# Altium project TIDA-00042.PrjPcb
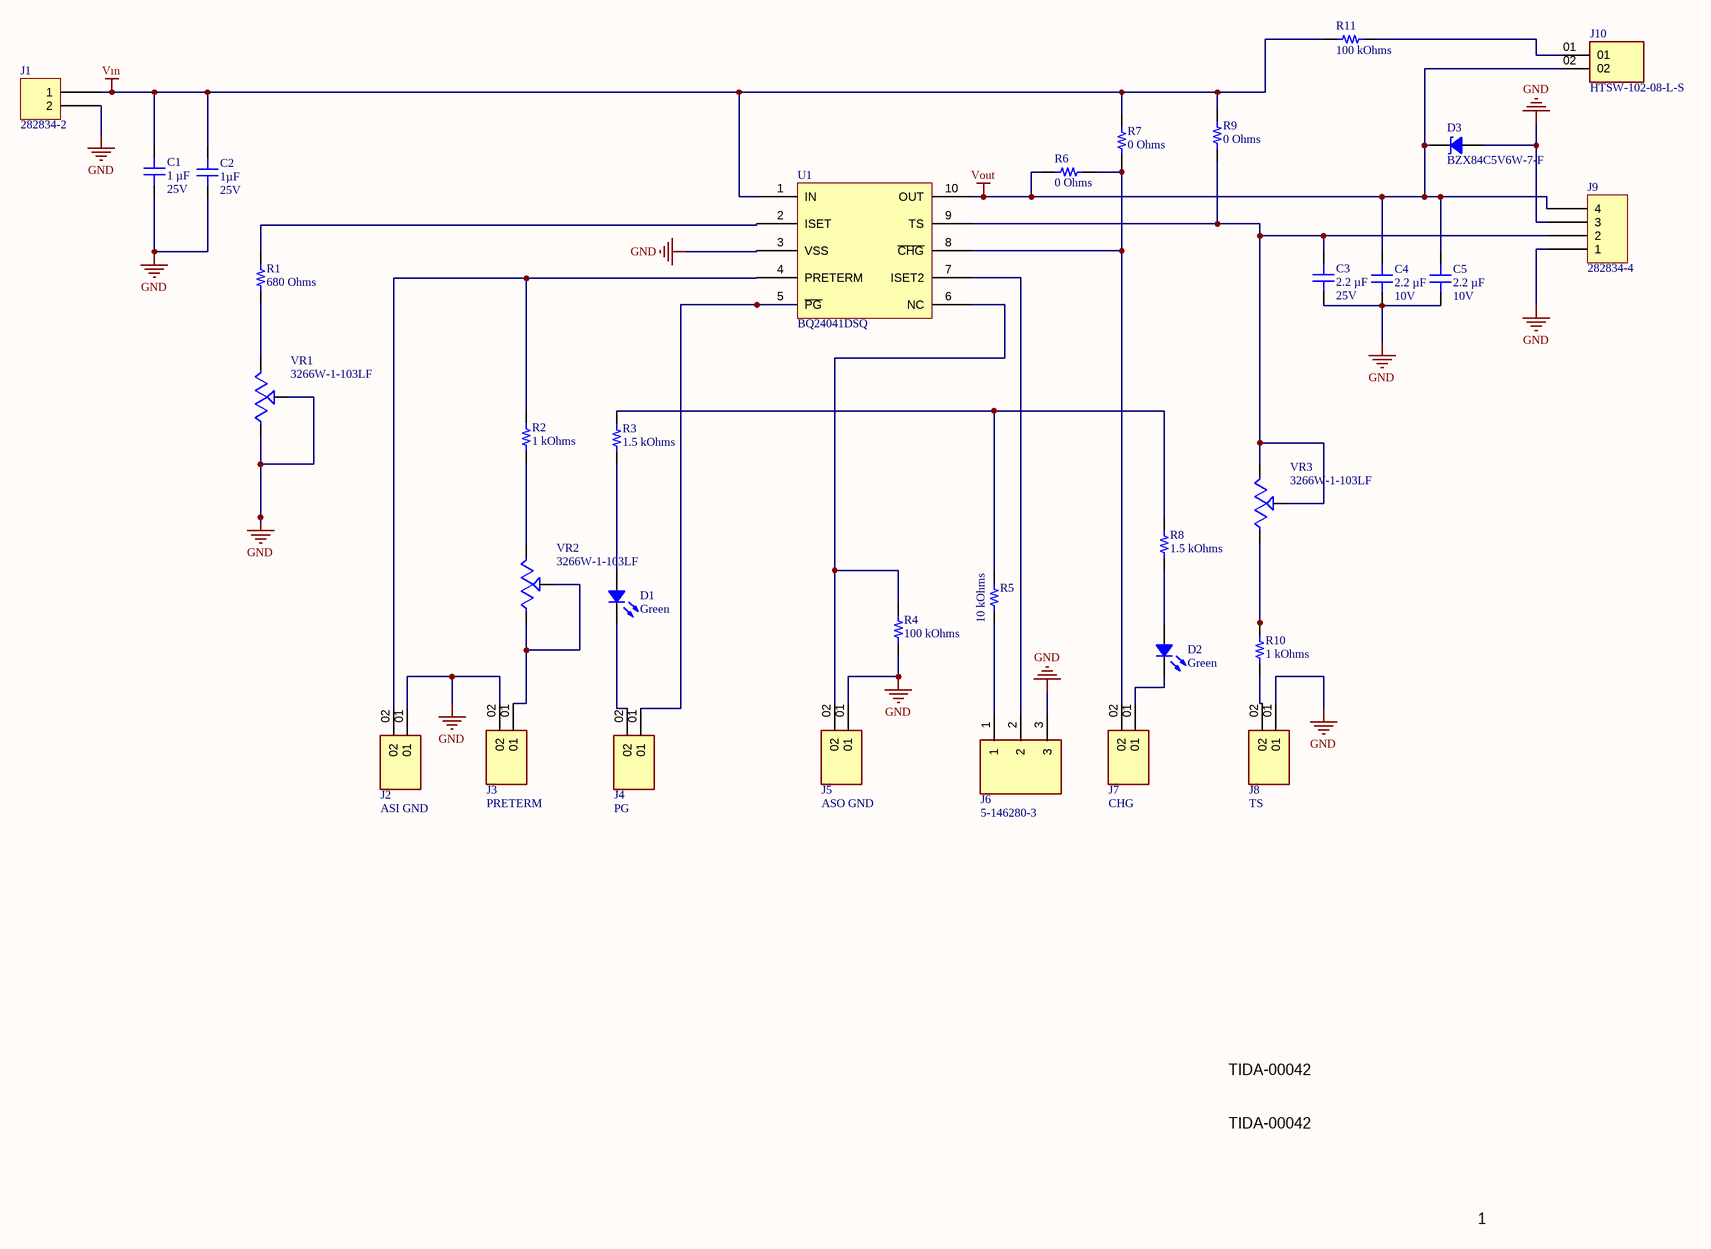
[diagram p0: TIDA-00042 SCHEMATİC.SchDoc]
1 sheet, 33 parts. Net scope: global (net labels, ports and power ports of the same name join across sheets).
Board file: TIDA-00042.PcbDoc

## Sheet TIDA-00042 SCHEMATİC.SchDoc
size 420 x 297 mm; SheetNumber: 1; SheetTotal: 1

### Parts
C1  Voltage - Rated: 25V  [CAP 0603_1608]  (hidden comment: 1 µF)
C2  Voltage - Rated: 25V  [CAP 0805_2012]  (hidden comment: 1µF)
C3  Voltage - Rated: 25V  [CAP 0603_1608]  (hidden comment: 2.2 µF)
C4  Voltage - Rated: 10V  [CAP 0603_1608]  (hidden comment: 2.2 µF)
C5  Voltage - Rated: 10V  [CAP 0805_2012]  (hidden comment: 2.2 µF)
D1  Green  [LED 0603_1608 GREEN]
D2  Green  [LED 0603_1608 GREEN]
D3  BZX84C5V6W-7-F  [DIODES SOT-323-3]
J1  282834-2  [TE 282834-2]
J2  ASI GND  [SAMTEC_HTSW-102-08-L-S]
J3  PRETERM  [SAMTEC_HTSW-102-08-L-S]
J4  PG  [SAMTEC_HTSW-102-08-L-S]
J5  ASO GND  [SAMTEC_HTSW-102-08-L-S]
J6  5-146280-3  [TE_5-146280-3]
J7  CHG  [SAMTEC_HTSW-102-08-L-S]
J8  TS  [SAMTEC_HTSW-102-08-L-S]
J9  282834-4  [TE 282834-4]
J10  HTSW-102-08-L-S  [SAMTEC_HTSW-102-08-L-S]
R1  680 Ohms  [RES 0603_1608]
R2  1 kOhms  [RES 0603_1608]
R3  1.5 kOhms  [RES 0603_1608]
R4  100 kOhms  [RES 0603_1608]
R5  10 kOhms  [RES 0603_1608]
R6  0 Ohms  [RES 0603_1608]
R7  0 Ohms  [RES 0603_1608]
R8  1.5 kOhms  [RES 0603_1608]
R9  0 Ohms  [RES 0603_1608]
R10  1 kOhms  [RES 0603_1608]
R11  100 kOhms  [RES 0603_1608]
U1  BQ24041DSQ  [SON40P200X200X80-11N]
VR1  3266W-1-103LF  [TRIM_3266W-1-103LF]
VR2  3266W-1-103LF  [TRIM_3266W-1-103LF]
VR3  3266W-1-103LF  [TRIM_3266W-1-103LF]

### Nets
GND: C1.1 C2.1 C3.1 C4.1 C5.1 D3.1 J1.2 J2.01 J3.02 J5.01 J6.3 J8.01 J9.1 J9.3 R4.1 U1.3(VSS) VR1.1(CCW) VR1.2(WIPER)
Vout: C4.2 C5.2 D3.2 J9.4 J10.02 R6.2 U1.10(OUT)
Vın: C1.2 C2.2 J1.1 R7.2 R9.2 R11.1 U1.1(IN)
NetC3_2: C3.2 J9.2 R9.1 U1.9(TS) VR3.2(WIPER) VR3.3(CW)
NetD1_1: D1.1 R3.1
NetD1_2: D1.2 J4.02
NetD2_1: D2.1 R8.1
NetD2_2: D2.2 J7.01
NetJ2_02: J2.02 R2.2 U1.4(PRETERM)
NetJ3_01: J3.01 VR2.1(CCW) VR2.2(WIPER)
NetJ4_01: J4.01 U1.5(~{PG})
NetJ5_02: J5.02 R4.2 U1.6(NC)
NetJ6_1: J6.1 R5.1
NetJ6_2: J6.2 U1.7(ISET2)
NetJ7_02: J7.02 R6.1 R7.1 U1.8(~{CHG})
NetJ8_02: J8.02 R10.1
NetJ10_01: J10.01 R11.2
NetR1_1: R1.1 VR1.3(CW)
NetR1_2: R1.2 U1.2(ISET)
NetR2_1: R2.1 VR2.3(CW)
NetR3_2: R3.2 R5.2 R8.2
NetR10_2: R10.2 VR3.1(CCW)

### Notes on the sheet
- TIDA-00042
- 1
- TİTLE:
- PROJECT:
- SİZE:
- A3
- DATE:
- REVİSİON:
- DRAW BY:
- MAHMUT AKÇAKOCA
- SHEET:

### Library data of the parts
C1 = CC0603KRX5R8BB105: CAP CER 1UF 25V X5R 0603; manufacturer: Yageo; Tolerance: ±10%; Part Number: CC0603KRX5R8BB105; Value: 1 µF; Applications: General Purpose; Capacitance: 1 µF; componentlink1description: Datasheet; componentlink1url: https://www.yageo.com/upload/media/product/productsearch/datasheet/mlcc/UPY-GPHC_X5R_4V-to-50V_25.pdf; componentlink2description: DigiKey Link; componentlink2url: https://www.digikey.com/en/products/detail/yageo/CC0603KRX5R8BB105/2833610; Device Package: 0603 (1608 Metric); lastupdated: 25.08.2022 06:49:33; Lifecycle Status: Active; Minimum Order: 1; Mounting Type: Surface Mount, MLCC; Operating Temperature: -55°C ~ 85°C; Package / Case: 0603 (1608 Metric); packaging: TapeAndReel; partid: 5146; Part Status: Active; price: 0.01; series: CC; Size / Dimension: 0.063" L x 0.031" W (1.60mm x 0.80mm); Supplier 1: DigiKey; Supplier Part Number 1: 311-1445-1-ND; Temperature Coefficient: X5R; Thickness (Max): 0.035" (0.90mm)
C2 = 08053D105KAT2A: CAP CER 1UF 25V X5R 0805; manufacturer: AVX Corporation; Tolerance: ±10%; Part Number: 08053D105KAT2A; Value: 1µF; Applications: General Purpose; Capacitance: 1µF; componentlink1description: Datasheet; componentlink1url: http://datasheets.avx.com/cx5r.pdf; componentlink2description: DigiKey Link; componentlink2url: http://digikey.com/product-detail/en/avx-corporation/08053D105KAT2A/478-1409-1-ND/564441; Device Package: 0805 (2012 Metric); lastupdated: 2.09.2020 01:04:40; Lifecycle Status: Active; Minimum Order: 1; Mounting Type: Surface Mount, MLCC; Operating Temperature: -55°C ~ 85°C; Package / Case: 0805 (2012 Metric); packaging: TapeAndReel; partid: 3127; Part Status: Active; price: 0.12; series: -; Size / Dimension: 0.079" L x 0.049" W (2.01mm x 1.25mm); Supplier 1: DigiKey; Supplier Part Number 1: 478-1409-1-ND; Temperature Coefficient: X5R; Thickness (Max): 0.055" (1.40mm)
C3 = CL10A225KA5LNNC: CAP CER 2.2UF 25V X5R 0603; manufacturer: Samsung Electro-Mechanics; Tolerance: ±10%; Part Number: CL10A225KA5LNNC; Value: 2.2 µF; Applications: General Purpose; Capacitance: 2.2 µF; componentlink1description: Datasheet; componentlink1url: http://www.samsungsem.com/kr/support/product-search/mlcc/CL10A225KA5LNNC.jsp; componentlink2description: DigiKey Link; componentlink2url: https://www.digikey.com/en/products/detail/samsung-electro-mechanics/CL10A225KA5LNNC/3887536; Device Package: 0603 (1608 Metric); Features: Low Profile; lastupdated: 25.08.2022 06:49:10; Lifecycle Status: Active; Minimum Order: 1; Mounting Type: Surface Mount, MLCC; Operating Temperature: -55°C ~ 85°C; Package / Case: 0603 (1608 Metric); packaging: TapeAndReel; partid: 12827; Part Status: Active; price: 0.03; series: CL; Size / Dimension: 0.063" L x 0.031" W (1.60mm x 0.80mm); Supplier 1: DigiKey; Supplier Part Number 1: 1276-1878-1-ND; Temperature Coefficient: X5R; Thickness (Max): 0.020" (0.50mm)
C4 = CL10A225KP8NNNC: CAP CER 2.2UF 10V X5R 0603; manufacturer: Samsung Electro-Mechanics; Tolerance: ±10%; Part Number: CL10A225KP8NNNC; Value: 2.2 µF; Applications: General Purpose; Capacitance: 2.2 µF; componentlink1description: Datasheet; componentlink1url: http://www.samsungsem.com/kr/support/product-search/mlcc/CL10A225KP8NNNC.jsp; componentlink2description: DigiKey Link; componentlink2url: https://www.digikey.com/en/products/detail/samsung-electro-mechanics/CL10A225KP8NNNC/3886743; Device Package: 0603 (1608 Metric); lastupdated: 25.08.2022 06:49:32; Lifecycle Status: Active; Minimum Order: 1; Mounting Type: Surface Mount, MLCC; Operating Temperature: -55°C ~ 85°C; Package / Case: 0603 (1608 Metric); packaging: TapeAndReel; partid: 5601; Part Status: Active; price: 0.01; series: CL; Size / Dimension: 0.063" L x 0.031" W (1.60mm x 0.80mm); Supplier 1: DigiKey; Supplier Part Number 1: 1276-1085-1-ND; Temperature Coefficient: X5R; Thickness (Max): 0.035" (0.90mm)
C5 = CC0805KKX5R6BB225: CAP CER 2.2UF 10V X5R 0805; manufacturer: Yageo; Tolerance: ±10%; Part Number: CC0805KKX5R6BB225; Value: 2.2 µF; Applications: General Purpose; Capacitance: 2.2 µF; componentlink1description: Datasheet; componentlink1url: https://www.yageo.com/upload/media/product/productsearch/datasheet/mlcc/UPY-GPHC_X5R_4V-to-50V_25.pdf; componentlink2description: DigiKey Link; componentlink2url: https://www.digikey.com/en/products/detail/yageo/CC0805KKX5R6BB225/5195268; Device Package: 0805 (2012 Metric); lastupdated: 25.08.2022 06:52:53; Lifecycle Status: Active; Minimum Order: 1; Mounting Type: Surface Mount, MLCC; Operating Temperature: -55°C ~ 85°C; Package / Case: 0805 (2012 Metric); packaging: TapeAndReel; partid: 41304; Part Status: Active; price: 0.04; series: CC; Size / Dimension: 0.079" L x 0.049" W (2.00mm x 1.25mm); Supplier 1: DigiKey; Supplier Part Number 1: 311-1862-1-ND; Temperature Coefficient: X5R; Thickness (Max): 0.057" (1.45mm)
D1 D2 = LTST-C190GKT: LED GREEN CLEAR CHIP SMD; Manufacturer: Lite-On Inc.; Configuration: Standard; Current - Test: 10mA; Lens Color: Colorless; Lens Size: 1.10mm x 0.80mm; Lens Style: Rectangle with Flat Top; Millicandela Rating: 6mcd; Viewing Angle: 130°; Voltage - Forward (Vf) (Typ): 2.1V; Wavelength - Dominant: 569nm; Wavelength - Peak: 565nm; Part Number: LTST-C190GKT; Color: Green; ComponentLink1Description: Datasheet; ComponentLink1URL: //media.digikey.com/pdf/Data%20Sheets/Lite-On%20PDFs/LTST-C190GKT.pdf; ComponentLink2Description: DigiKey Link; ComponentLink2URL: http://digikey.com/product-detail/en/lite-on-inc/LTST-C190GKT/160-1183-1-ND/269255; Device Package: 0603 (1608 Metric); Height (Max): 0.90mm; LastUpdated: 25.08.2022 07:37:41; Lens Transparency: Clear; Lifecycle Status: Active; Minimum Order: 1; Mounting Type: Surface Mount; Package / Case: 0603 (1608 Metric); Packaging: TapeAndReel; PartId: 656; Part Status: Active; Price: 0.04; Series: -; Size / Dimension: 1.60mm L x 0.80mm W; Supplier 1: DigiKey; Supplier Part Number 1: 160-1183-1-ND; Supplier Device Package: Chip LED; Value: Green
D3 = BZX84C5V6W-7-F: DIODE ZENER 5.6V 200MW SOT323; Manufacturer: Diodes Incorporated; Current - Reverse Leakage @ Vr: 1 µA @ 2 V; Impedance (Max) (Zzt): 40 Ohms; Tolerance: ±7%; Voltage - Forward (Vf) (Max) @ If: 900 mV @ 10 mA; Part Number: BZX84C5V6W-7-F; ComponentLink1Description: Datasheet; ComponentLink1URL: https://www.diodes.com/assets/Datasheets/ds30066.pdf; ComponentLink2Description: DigiKey Link; ComponentLink2URL: https://www.digikey.com/en/products/detail/diodes-incorporated/BZX84C5V6W-7-F/814913; LastUpdated: 25.08.2022 07:38:41; Lifecycle Status: Active; Minimum Order: 1; Mounting Type: Surface Mount; Operating Temperature: -65°C ~ 125°C; Package / Case: SC-70, SOT-323; Packaging: TapeAndReel; PartId: 879; Part Status: Active; Power - Max: 200 mW; Price: 0.04; Series: -; Supplier 1: DigiKey; Supplier Part Number 1: BZX84C5V6W-FDICT-ND; Supplier Device Package: SOT-323; Voltage - Zener (Nom) (Vz): 5.6 V
J1 = 282834-2: TERM BLK 2P SIDE ENT 2.54MM PCB; Manufacturer: TE Connectivity AMP Connectors; Current: 10A; Mating Orientation: Horizontal with Board; Number of Levels: 1; Pitch: 0.100" (2.54mm); Positions Per Level: 2; Voltage: 150V; Wire Gauge: 16-30 AWG; Wire Termination: Screw - Rising Cage Clamp; Part Number: 282834-2; Color: Green; ComponentLink1Description: Datasheet; ComponentLink1URL: https://www.te.com/commerce/DocumentDelivery/DDEController?Action=srchrtrv&DocNm=282834&DocType=Customer+Drawing&DocLang=English; ComponentLink2Description: DigiKey Link; ComponentLink2URL: http://digikey.com/product-detail/en/te-connectivity-amp-connectors/282834-2/A98333-ND/1150135; LastUpdated: 15.01.2020 04:15:38; Lifecycle Status: Active; Minimum Order: 1; Mounting Type: Through Hole; Packaging: Bulk; Part Status: Active; Price: 0.88; Series: Buchanan; Supplier 1: DigiKey; Supplier Part Number 1: A98333-ND
J2-J5 J7 J8 J10 = HTSW-102-08-L-S: Conn Unshrouded Header HDR 2 POS 2.54mm Solder ST Top Entry Thru-Hole Bag; MF: Samtec Inc.; MP: HTSW-102-08-L-S; Value: *; Availability: In Stock; Package: None; Price: None; SnapEDA_Link: https://www.snapeda.com/parts/HTSW-102-08-L-S/Samtec/view-part/?ref=snap; Purchase-URL: https://pricing.snapeda.com/search/part/HTSW-102-08-L-S/?ref=eda; Check_prices: https://www.snapeda.com/parts/HTSW-102-08-L-S/Samtec/view-part/?ref=eda
J6 = 5-146280-3: Header; Conn; Interconnect System; PCB Plug; 3 Cont; Thru-Hole; Breakaway; Straight; 3A; Centerline_Pitch: 2.54 mm[.1 in]; MF: TE Connectivity; Product_Type: Connector; Number_of_Positions: 3; SnapEDA_Link: https://www.snapeda.com/parts/5-146280-3/TE%20Connectivity%20AMP%20Connectors/view-part/2778485/?ref=snap; MP: 5-146280-3; TE_purchase_URL: https://www.te.com/usa-en/product-5-146280-3.html?te_bu=Cor&te_type=disp&te_campaign=seda_glo_cor-seda-global-disp-prtnr-fy19-seda-model-bom-cta_sma-317_1&elqCampaignId=32493; Availability: Unavailable; Price: None; Package: None; Value: *
J9 = 282834-4: TERM BLK 4P SIDE ENT 2.54MM PCB; Manufacturer: TE Connectivity AMP Connectors; Current: 10A; Mating Orientation: Horizontal with Board; Number of Levels: 1; Pitch: 0.100" (2.54mm); Positions Per Level: 4; Voltage: 150V; Wire Gauge: 16-30 AWG; Wire Termination: Screw - Rising Cage Clamp; Part Number: 282834-4; Color: Green; ComponentLink1Description: Datasheet; ComponentLink1URL: https://www.te.com/commerce/DocumentDelivery/DDEController?Action=srchrtrv&DocNm=282834&DocType=Customer+Drawing&DocLang=English; ComponentLink2Description: DigiKey Link; ComponentLink2URL: http://digikey.com/product-detail/en/te-connectivity-amp-connectors/282834-4/A98335-ND/1153265; LastUpdated: 15.01.2020 04:16:05; Lifecycle Status: Active; Minimum Order: 1; Mounting Type: Through Hole; Packaging: Bulk; Part Status: Active; Price: 2.68; Series: Buchanan; Supplier 1: DigiKey; Supplier Part Number 1: A98335-ND
R1 = CRCW0603680RFKEA: RES SMD 680 OHM 1% 1/10W 0603; Manufacturer: Vishay Dale; Power (Watts): 0.1W, 1/10W; Temperature Coefficient: ±100ppm/°C; Part Number: CRCW0603680RFKEA; Value: 680 Ohms; ComponentLink1Description: Datasheet; ComponentLink1URL: http://www.vishay.com/docs/20035/dcrcwe3.pdf; ComponentLink2Description: DigiKey Link; ComponentLink2URL: http://digikey.com/product-detail/en/vishay-dale/CRCW0603680RFKEA/541-680HCT-ND/1179790; Composition: Thick Film; Device Package: 0603 (1608 Metric); Features: Automotive AEC-Q200; Height - Seated (Max): 0.020" (0.50mm); LastUpdated: 25.08.2022 07:11:26; Lifecycle Status: Active; Minimum Order: 1; Number of Terminations: 2; Operating Temperature: -55°C ~ 155°C; Package / Case: 0603 (1608 Metric); Packaging: CutTape; PartId: 12674; Part Status: Active; Price: 0.10; Ratings: AEC-Q200; Resistance: 680 Ohms; Series: CRCW; Size / Dimension: 0.061" L x 0.033" W (1.55mm x 0.85mm); Supplier 1: DigiKey; Supplier Part Number 1: 541-680HCT-ND; Supplier Device Package: 0603; Tolerance: ±1%
R2 R10 = CPF0603F1K0C1: RES SMD 1K OHM 1% 1/16W 0603; Manufacturer: TE Connectivity Passive Product; Power (Watts): 0.063W, 1/16W; Temperature Coefficient: ±50ppm/°C; Part Number: CPF0603F1K0C1; Value: 1 kOhms; ComponentLink1Description: Datasheet; ComponentLink1URL: https://www.te.com/commerce/DocumentDelivery/DDEController?Action=srchrtrv&DocNm=1773200&DocType=DS&DocLang=English; ComponentLink2Description: DigiKey Link; ComponentLink2URL: https://www.digikey.com/en/products/detail/te-connectivity-passive-product/CPF0603F1K0C1/2384390; Composition: Thin Film; Device Package: 0603 (1608 Metric); Height - Seated (Max): 0.022" (0.55mm); LastUpdated: 25.08.2022 07:11:04; Lifecycle Status: Active; Minimum Order: 1; Number of Terminations: 2; Operating Temperature: -55°C ~ 155°C; Package / Case: 0603 (1608 Metric); Packaging: TapeAndReel; PartId: 18751; Part Status: Active; Price: 0.03; Resistance: 1 kOhms; Series: CPF, Neohm; Size / Dimension: 0.061" L x 0.031" W (1.55mm x 0.80mm); Supplier 1: DigiKey; Supplier Part Number 1: A102226CT-ND; Supplier Device Package: 0603; Tolerance: ±1%
R3 R8 = CRCW06031K50FKEA: RES SMD 1.5K OHM 1% 1/10W 0603; Manufacturer: Vishay Dale; Power (Watts): 0.1W, 1/10W; Temperature Coefficient: ±100ppm/°C; Part Number: CRCW06031K50FKEA; Value: 1.5 kOhms; ComponentLink1Description: Datasheet; ComponentLink1URL: http://www.vishay.com/docs/20035/dcrcwe3.pdf; ComponentLink2Description: DigiKey Link; ComponentLink2URL: http://digikey.com/product-detail/en/vishay-dale/CRCW06031K50FKEA/541-1.50KHCT-ND/1179827; Composition: Thick Film; Device Package: 0603 (1608 Metric); Features: Automotive AEC-Q200; Height - Seated (Max): 0.020" (0.50mm); LastUpdated: 25.08.2022 07:11:26; Lifecycle Status: Active; Minimum Order: 1; Number of Terminations: 2; Operating Temperature: -55°C ~ 155°C; Package / Case: 0603 (1608 Metric); Packaging: CutTape; PartId: 12648; Part Status: Active; Price: 0.10; Ratings: AEC-Q200; Resistance: 1.5 kOhms; Series: CRCW; Size / Dimension: 0.061" L x 0.033" W (1.55mm x 0.85mm); Supplier 1: DigiKey; Supplier Part Number 1: 541-1.50KHCT-ND; Supplier Device Package: 0603; Tolerance: ±1%
R4 R11 = CRCW0603100KFKEBC: RES 100K OHM 1% 1/10W 0603; Manufacturer: Vishay Dale; Power (Watts): 0.1W, 1/10W; Temperature Coefficient: ±100ppm/°C; Part Number: CRCW0603100KFKEBC; Value: 100 kOhms; ComponentLink1Description: Datasheet; ComponentLink1URL: https://www.vishay.com/docs/28773/crcwce3.pdf; ComponentLink2Description: DigiKey Link; ComponentLink2URL: https://www.digikey.com/en/products/detail/vishay-dale/CRCW0603100KFKEBC/7924353; Composition: Thick Film; Device Package: 0603 (1608 Metric); Height - Seated (Max): 0.022" (0.55mm); LastUpdated: 25.08.2022 07:09:47; Lifecycle Status: Active; Minimum Order: 1; Number of Terminations: 2; Operating Temperature: -55°C ~ 155°C; Package / Case: 0603 (1608 Metric); Packaging: CutTape; PartId: 66785; Part Status: Active; Price: 0.01; Resistance: 100 kOhms; Series: CRCW-C; Size / Dimension: 0.063" L x 0.031" W (1.60mm x 0.80mm); Supplier 1: DigiKey; Supplier Part Number 1: 541-CRCW0603100KFKEBCCT-ND; Supplier Device Package: 0603; Tolerance: ±1%
R5 = CPF0603F10KC1: RES SMD 10K OHM 1% 1/16W 0603; Manufacturer: TE Connectivity Passive Product; Power (Watts): 0.063W, 1/16W; Temperature Coefficient: ±50ppm/°C; Part Number: CPF0603F10KC1; Value: 10 kOhms; ComponentLink1Description: Datasheet; ComponentLink1URL: https://www.te.com/commerce/DocumentDelivery/DDEController?Action=srchrtrv&DocNm=1773200&DocType=DS&DocLang=English; ComponentLink2Description: DigiKey Link; ComponentLink2URL: https://www.digikey.com/en/products/detail/te-connectivity-passive-product/CPF0603F10KC1/2384568; Composition: Thin Film; Device Package: 0603 (1608 Metric); Height - Seated (Max): 0.022" (0.55mm); LastUpdated: 25.08.2022 07:11:04; Lifecycle Status: Active; Minimum Order: 1; Number of Terminations: 2; Operating Temperature: -55°C ~ 155°C; Package / Case: 0603 (1608 Metric); Packaging: TapeAndReel; PartId: 18824; Part Status: Active; Price: 0.03; Resistance: 10 kOhms; Series: CPF, Neohm; Size / Dimension: 0.061" L x 0.031" W (1.55mm x 0.80mm); Supplier 1: DigiKey; Supplier Part Number 1: A102203CT-ND; Supplier Device Package: 0603; Tolerance: ±1%
R6 R7 R9 = CRG0603ZR: RES SMD 0 OHM JUMPER 1/10W 0603; Manufacturer: TE Connectivity Passive Product; Power (Watts): 0.1W, 1/10W; Part Number: CRG0603ZR; Value: 0 Ohms; ComponentLink1Description: Datasheet; ComponentLink1URL: https://www.te.com/commerce/DocumentDelivery/DDEController?Action=srchrtrv&DocNm=1773204&DocType=DS&DocLang=English; ComponentLink2Description: DigiKey Link; ComponentLink2URL: https://www.digikey.com/en/products/detail/te-connectivity-passive-product/CRG0603ZR/2380828; Composition: Thick Film; Device Package: 0603 (1608 Metric); Height - Seated (Max): 0.022" (0.55mm); LastUpdated: 25.08.2022 07:10:39; Lifecycle Status: Active; Minimum Order: 1; Number of Terminations: 2; Operating Temperature: -55°C ~ 155°C; Package / Case: 0603 (1608 Metric); Packaging: CutTape; PartId: 23963; Part Status: Active; Price: 0.01; Resistance: 0 Ohms; Series: CRG, Neohm; Size / Dimension: 0.063" L x 0.031" W (1.60mm x 0.80mm); Supplier 1: DigiKey; Supplier Part Number 1: A106051CT-ND; Supplier Device Package: 0603; Tolerance: Jumper
VR1-VR3 = 3266W-1-103LF: 10 kOhms 0.25W, 1/4W PC Pins Through Hole Trimmer Potentiometer Cermet 12 Turn Top Adjustment; MF: Bourns; Package: 3266 Bourns; MP: 3266W-1-103LF; Availability: Good; SnapEDA_Link: https://www.snapeda.com/parts/3266W-1-103LF/Bourns%20-%20J.W.%20Miller/view-part/49286/?ref=snap; Price: None; Check_prices: https://www.snapeda.com/parts/3266W-1-103LF/Bourns%20-%20J.W.%20Miller/view-part/49286/?ref=eda; Value: *; Purchase-URL: https://pricing.snapeda.com/search/part/3266W-1-103LF/?ref=eda